# EAGLE design LED_10 (EAGLE 9.6.2)
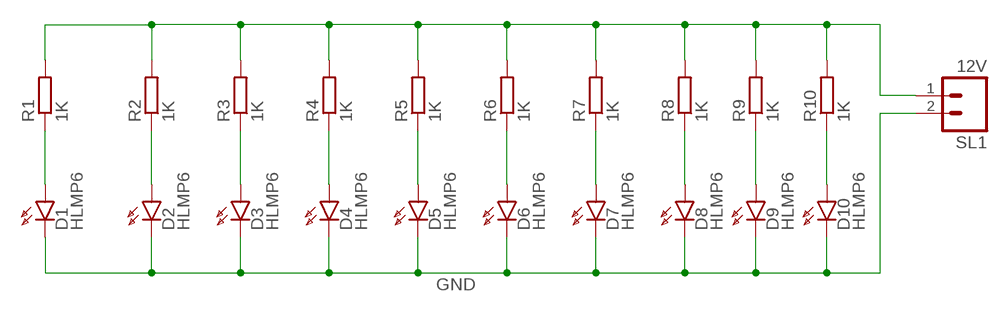
[diagram p0: schematic, sheet 1]

## Parts
D1  HLMP6  [HLMP6]
D2  HLMP6  [HLMP6]
D3  HLMP6  [HLMP6]
D4  HLMP6  [HLMP6]
D5  HLMP6  [HLMP6]
D6  HLMP6  [HLMP6]
D7  HLMP6  [HLMP6]
D8  HLMP6  [HLMP6]
D9  HLMP6  [HLMP6]
D10  HLMP6  [HLMP6]
R1  1K  R-EU_0204/7  [0204/7]
R2  1K  R-EU_0204/7  [0204/7]
R3  1K  R-EU_0204/7  [0204/7]
R4  1K  R-EU_0204/7  [0204/7]
R5  1K  R-EU_0204/7  [0204/7]
R6  1K  R-EU_0204/7  [0204/7]
R7  1K  R-EU_0204/7  [0204/7]
R8  1K  R-EU_0204/7  [0204/7]
R9  1K  R-EU_0204/7  [0204/7]
R10  1K  R-EU_0204/7  [0204/7]
SL1  12V  M02  [02P]

## Nets
GND: D1.K D2.K D3.K D4.K D5.K D6.K D7.K D8.K D9.K D10.K SL1.2
N$1: D1.A R1.1
N$2: D2.A R2.1
N$3: R1.2 R2.2 R3.2 R4.2 R5.2 R6.2 R7.2 R8.2 R9.2 R10.2 SL1.1
N$4: D3.A R3.1
N$5: D4.A R4.1
N$6: D5.A R5.1
N$7: D6.A R6.1
N$8: D7.A R7.1
N$9: D8.A R8.1
N$10: D9.A R9.1
N$11: D10.A R10.1

## Library data of the parts
D1-D10 = display-hp:HLMP6: LED 2mm horizontal; MF: AGILENT TECHNOLOGIES; MPN: HLMP-6500; OC_FARNELL: 1652490; OC_NEWARK: 40K0088
R1-R10 = rcl:R-EU_: RESISTOR, European symbol; SPICEPREFIX: R
SL1 = con-amp-quick:M02: AMP QUICK CONNECTOR; OC_FARNELL: unknown; OC_NEWARK: unknown

## Board
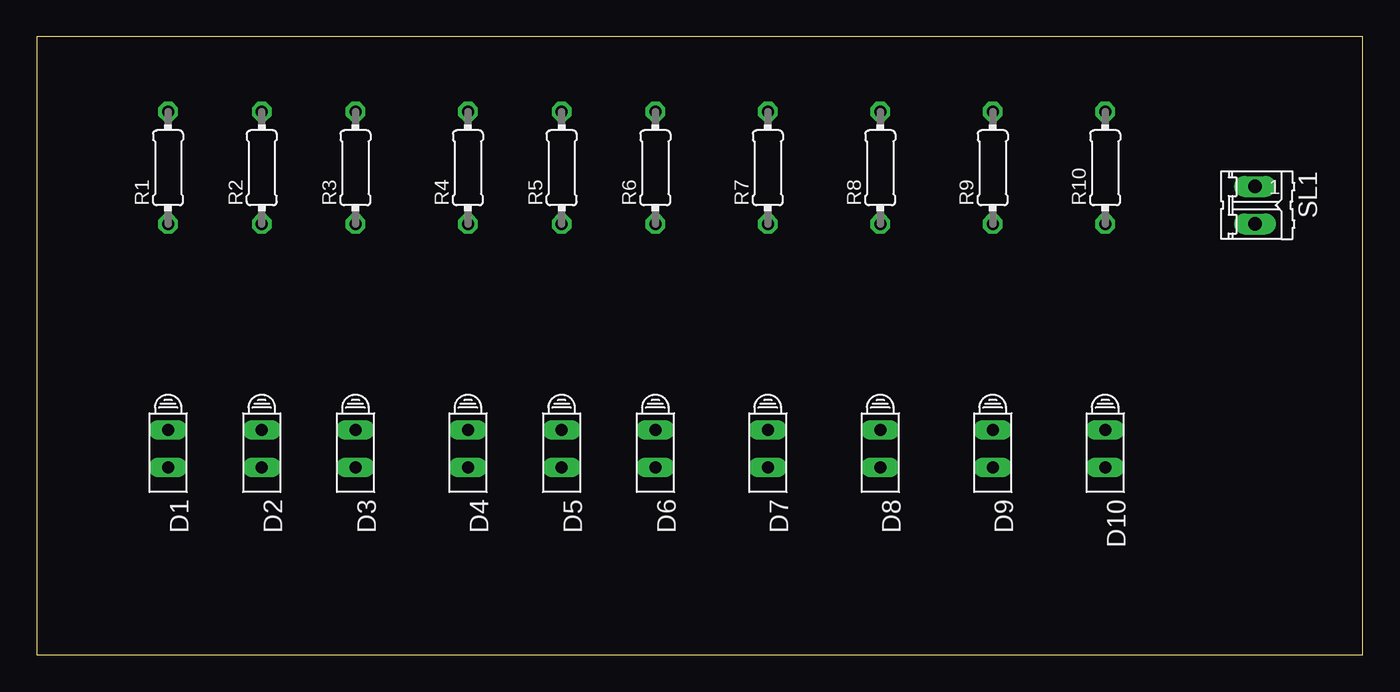
[diagram p1: board, top side]
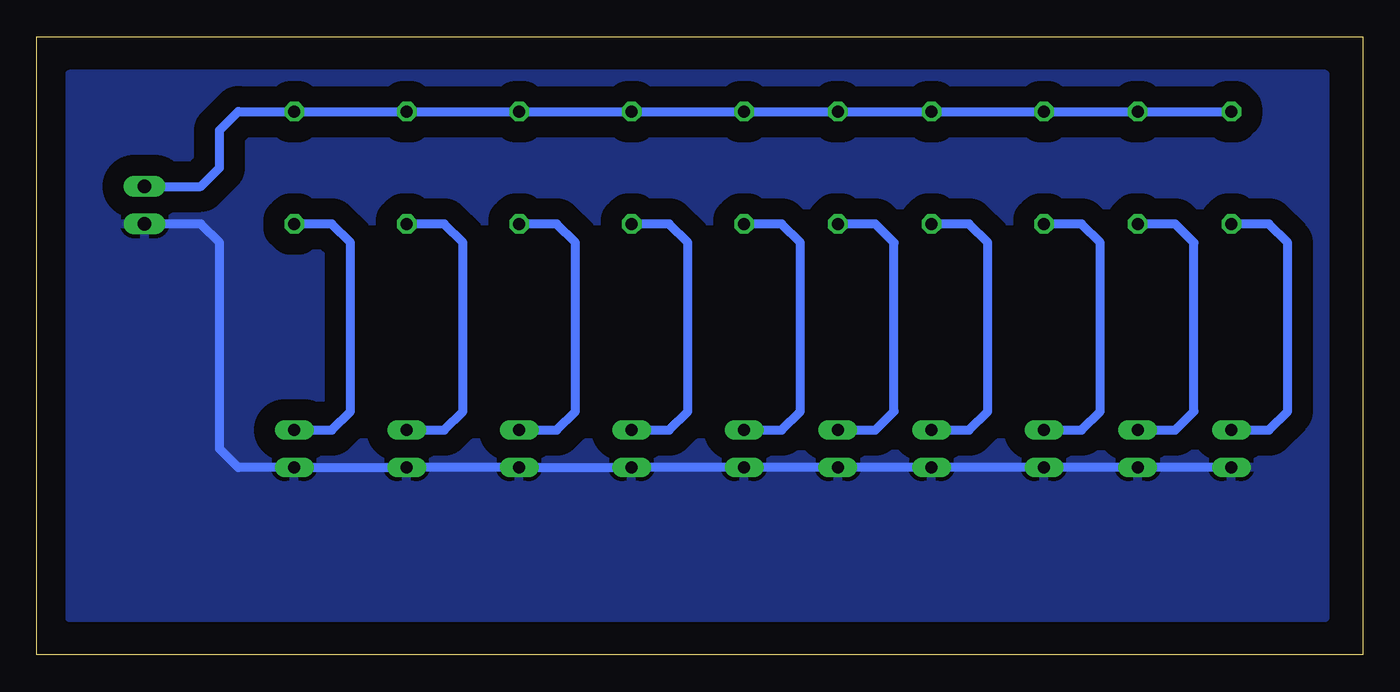
[diagram p2: board, bottom side, seen from below]

Size 89.84 x 41.9 mm. Coordinates in mm from the lower left corner, seen from the top.
Outline: 0,0 89.84,0 89.84,41.9 0,41.9 0,0
Copper layers (1*16): Top 0.035mm / dielectric 1.5mm / Bottom 0.035mm
Design rules "default": minimum track width 6mil, minimum drill 0.35mm, track to track 6mil, track to pad 6mil, pad to pad 6mil, via to via 6mil, smd to smd 6mil, copper to edge 40mil, drill to drill 6mil, minimum pad ring 10mil, minimum via ring 8mil, stop-mask expansion 4mil, vias tented up to drill 0mil, thermal gap 10mil

### Footprints (pad centres in the part's own frame; a part is rotated, then mirrored left to right if it is on the bottom)
HLMP6 = drill 0.813 long: A -1.27,0; K 1.27,0
0204/7 = drill 0.813 octagon: 1 -3.81,0; 2 3.81,0
02P = drill 0.914 long: 1 -1.27,0; 2 1.27,0

### Placement (x,y rotation side)
D1  8.89,13.97 270 top
D2  15.24,13.97 270 top
D3  21.59,13.97 270 top
D4  29.21,13.97 270 top
D5  35.56,13.97 270 top
D6  41.91,13.97 270 top
D7  49.53,13.97 270 top
D8  57.15,13.97 270 top
D9  64.77,13.97 270 top
D10  72.39,13.97 270 top
R1  8.89,33.02 90 top
R2  15.24,33.02 90 top
R3  21.59,33.02 90 top
R4  29.21,33.02 90 top
R5  35.56,33.02 90 top
R6  41.91,33.02 90 top
R7  49.53,33.02 90 top
R8  57.15,33.02 90 top
R9  64.77,33.02 90 top
R10  72.39,33.02 90 top
SL1  82.55,30.48 270 top

### Tracks (layer width: path | path; a pad name or v marks a point on that pad's centre or on a via)
GND
  Bottom 0.61: D1.K D2.K D3.K D4.K D5.K D6.K D7.K D8.K D9.K D10.K 76.2,12.7 77.47,13.97 77.47,27.94 78.74,29.21 SL1.2
  pour Bottom (isolate 1.422): 3.81,39.37 87.63,39.37 87.63,2.54 2.54,2.54 2.54,39.37
N$1
  Bottom 0.61: D1.A 6.35,15.24 5.08,16.51 5.08,27.94 6.35,29.21 R1.1
N$2
  Bottom 0.61: D2.A 12.7,15.24 11.43,16.51 11.43,27.94 12.7,29.21 R2.1
N$3
  Bottom 0.61: SL1.1 78.74,31.75 77.47,33.02 77.47,35.56 76.2,36.83 R10.2 R9.2 R8.2 R7.2 R6.2 R5.2 R4.2 R3.2 R2.2 R1.2
N$4
  Bottom 0.61: D3.A 19.05,15.24 17.78,16.51 17.78,27.94 19.05,29.21 R3.1
N$5
  Bottom 0.61: D4.A 26.67,15.24 25.4,16.51 25.4,27.94 26.67,29.21 R4.1
N$6
  Bottom 0.61: D5.A 33.02,15.24 31.75,16.51 31.75,27.94 33.02,29.21 R5.1
N$7
  Bottom 0.61: D6.A 39.37,15.24 38.1,16.51 38.1,27.94 39.37,29.21 R6.1
N$8
  Bottom 0.61: D7.A 46.99,15.24 45.72,16.51 45.72,27.94 46.99,29.21 R7.1
N$9
  Bottom 0.61: D8.A 54.61,15.24 53.34,16.51 53.34,27.94 54.61,29.21 R8.1
N$10
  Bottom 0.61: D9.A 62.23,15.24 60.96,16.51 60.96,27.94 62.23,29.21 R9.1
N$11
  Bottom 0.61: D10.A 69.85,15.24 68.58,16.51 68.58,27.94 69.85,29.21 R10.1